# EAGLE schematic Motion Shield v1 (EAGLE 5.11)
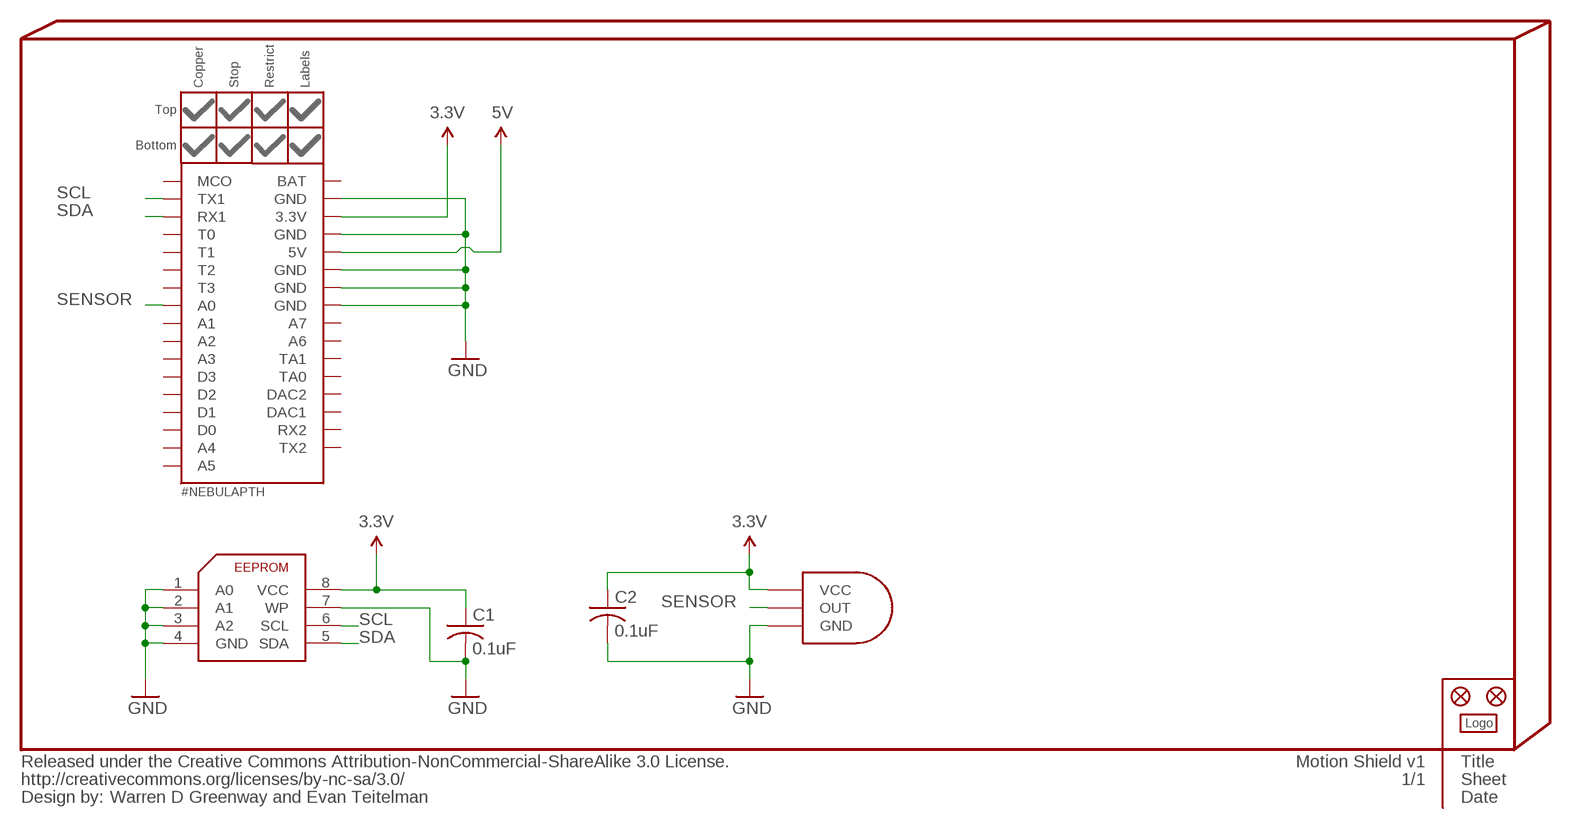
[diagram p0: schematic, sheet 1]

## Parts
C1  0.1uF  C-USC0402  [C0402]
C2  0.1uF  C-USC0402  [C0402]
INFO2  Warren D Greenway and Evan Teitelman  %CC-NC-SA  [%CC-NC-SA]
JP1  FIDUCIAL1.5X3  [FIDUCIAL-1.5X3]
JP2  FIDUCIAL1.5X3  [FIDUCIAL-1.5X3]
LOGO1  #PYGMYLOGONORMAL  #PYGMYLOGOLARGE  [#PYGMYLOGO]
NEBULA1  #NEBULAPTH  [#NEBULA-PTH]
NEBULAPART1  #NEBULA-PARTRESTRICT  [#NEBULA-RESTRICT]
NEBULAPART2  #NEBULA-PARTLABELS-TOP  [#NEBULA-LABELS-TOP]
NEBULAPART3  #NEBULA-PARTCOPPER  [#NEBULA-COPPER]
NEBULAPART4  #NEBULA-PARTSTOP  [#NEBULA-STOP]
U1  EEPROM-ATMEL-AT24HC02B  [TSSOP8]
U2  PANASONIC-AMN41122  [PANASONIC-AMN41122]

## Nets
3.3V: C1.1 C2.1 NEBULA1.3.3V U1.8(VCC) U2.VCC ; supply symbol labelled @3.3V
5V: NEBULA1.5V ; supply symbol labelled @5V
GND: C1.2 C2.2 NEBULA1.GND1(GND) NEBULA1.GND2(GND) NEBULA1.GND3(GND) NEBULA1.GND4(GND) NEBULA1.GND5(GND) U1.1(A0) U1.2(A1) U1.3(A2) U1.4(GND) U1.7(WP) U2.GND ; supply symbol labelled @GND
SCL: NEBULA1.COM1_TX(TX1) U1.6(SCL)
SDA: NEBULA1.COM1_RX(RX1) U1.5(SDA)
SENSOR: NEBULA1.A0 U2.OUT
Unconnected: NEBULA1.A1 NEBULA1.A2 NEBULA1.A3 NEBULA1.A4 NEBULA1.A5 NEBULA1.A6 NEBULA1.A7 NEBULA1.BAT NEBULA1.COM2_RX(RX2) NEBULA1.COM2_TX(TX2) NEBULA1.D0 NEBULA1.D1 NEBULA1.D2 NEBULA1.D3 NEBULA1.DAC1 NEBULA1.DAC2 NEBULA1.MCO NEBULA1.T0 NEBULA1.T1 NEBULA1.T2 NEBULA1.T3 NEBULA1.TA0 NEBULA1.TA1

## Library data of the parts
C1 C2 = rcl:C-US: CAPACITOR, American symbol
INFO2 = PygmyBoards:%CC-NC-SA: Released under the Creative Commons Attribution-NonCommercial-ShareAlike 3.0 License. http://creativecommons.org/licenses/by-sa/3.0 Design by: [Designer Name] Change this part's value to change the designer name
JP1 JP2 = SparkFun:FIDUCIAL: Fiducial Alignment Points Various fiducial points for machine vision alignment.
LOGO1 = Pygmy:#PYGMYLOGO
NEBULA1 = PygmyBoards:#NEBULA: Nebula Board and Shield Footprint Pads This is the only absolutely required part for the footprint. The parts in "#NEBULA-PART" are merely aesthetic. A circular board outline should be .001" thick and 1.005" in diameter (Reference circle on the Document (48) layer provided).
NEBULAPART1-NEBULAPART4 = PygmyBoards:#NEBULA-PART: Nebula Board and Shield Footprint Parts These parts are only functional when combined with the pads in "#NEBULA".
U1 = Pygmy:EEPROM-ATMEL-AT24HC02B
U2 = Pygmy:PANASONIC-AMN41122